# EAGLE design temp-sensor (EAGLE 9.6.2)
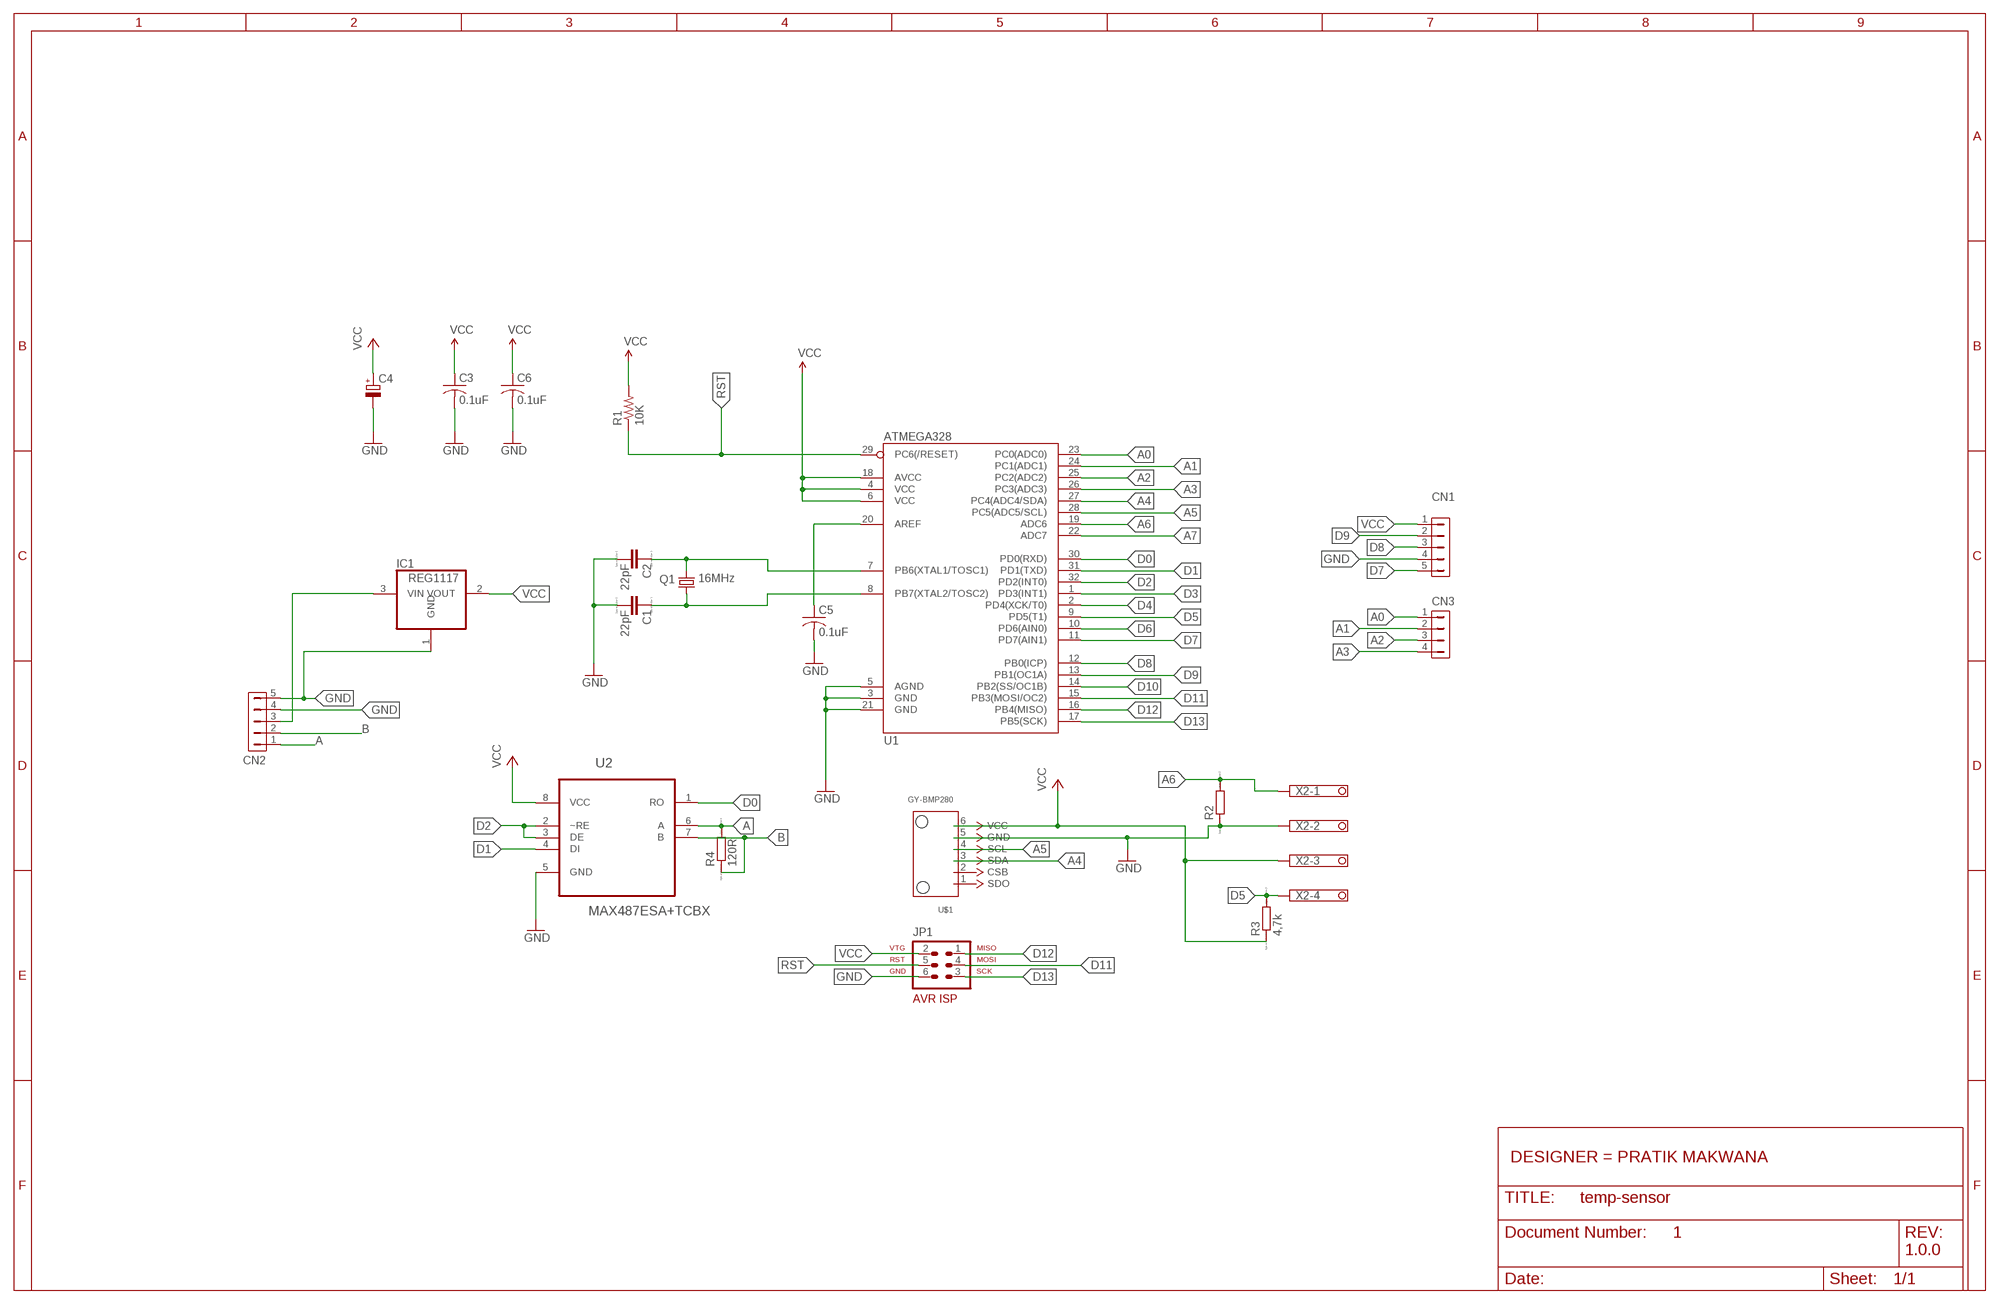
[diagram p0: schematic, sheet 1]
FRAME1 (FRAME_B_L): DESIGNER: PRATIK MAKWANA; DOC: 1; REV: 1.0.0

## Parts
C1  22pF  C  [C0805]
C2  22pF  C  [C0805]
C3  0.1uF  C-USC0805  [C0805]
C4  CPOL-EUSANYO_SMD_C6  [SANYO-OSCON_SMD_C6]
C5  0.1uF  C-USC0805  [C0805]
C6  0.1uF  C-USC0805  [C0805]
CN1  HDR-1X5-SIP-100  [SIP-100-5V]
CN2  HDR-1X5-SIP-100  [SIP-100-5V]
CN3  HDR-1X4-SIP-100  [SIP-100-4V]
IC1  REG1117  [SOT223]
JP1  AVR-ISP-6  [AVR-ISP-6]
Q1  16MHz  CRYTALHC49S  [HC49/S]
R1  10K  R-US_R1206  [R1206]
R2  RR1206  [R1206]
R3  4,7k  RR1206  [R1206]
R4  120R  RR0603  [R0603]
U1  ATMEGA328  [TQFP32-08]
U2  MAX487ESA+TCBX  [SOIC127P600X175-8N]
U$1  GY-BMP280  [GY-BMP280]
X2  TERMINAL-BLOCK-3.5MM-4-PIN-LONG-PAD  [TERMINAL-BLOCK-4-PIN-3.5MM-LONG-PAD]

## Nets
A: CN2.1 R4.2 U2.6(A)
A0: CN3.1 U1.23(PC0(ADC0))
A1: CN3.2 U1.24(PC1(ADC1))
A2: CN3.3 U1.25(PC2(ADC2))
A3: CN3.4 U1.26(PC3(ADC3))
A4: U1.27(PC4(ADC4/SDA)) U$1.3(SDA)
A5: U1.28(PC5(ADC5/SCL)) U$1.4(SCL)
A6: R2.2 U1.19(ADC6) X2.1
A7: U1.22(ADC7)
AREF: C5.1 U1.20(AREF)
B: CN2.2 R4.1 U2.7(B)
D0: U1.30(PD0(RXD)) U2.1(RO)
D1: U1.31(PD1(TXD)) U2.4(DI)
D2: U1.32(PD2(INT0)) U2.2(~RE) U2.3(DE)
D3: U1.1(PD3(INT1))
D4: U1.2(PD4(XCK/T0))
D5: R3.2 U1.9(PD5(T1)) X2.4
D6: U1.10(PD6(AIN0))
D7: CN1.5 U1.11(PD7(AIN1))
D8: CN1.3 U1.12(PB0(ICP))
D9: CN1.2 U1.13(PB1(OC1A))
D10: U1.14(PB2(SS/OC1B))
D11: JP1.4 U1.15(PB3(MOSI/OC2))
D12: JP1.1 U1.16(PB4(MISO))
D13: JP1.3 U1.17(PB5(SCK))
GND: C1.2 C2.2 C3.2 C4.- C5.2 C6.2 CN1.4 CN2.4 CN2.5 IC1.1(GND) JP1.6 R2.1 U1.3(GND) U1.5(AGND) U1.21(GND) U2.5(GND) U$1.5(GND) X2.2
N$3: CN2.3 IC1.3(VIN)
N$43: C2.1 Q1.2 U1.7(PB6(XTAL1/TOSC1))
N$44: C1.1 Q1.1 U1.8(PB7(XTAL2/TOSC2))
RST: JP1.5 R1.1 U1.29(PC6(/RESET))
VCC: C3.1 C4.+ C6.1 CN1.1 IC1.2(VOUT) JP1.2 R1.2 R3.1 U1.4(VCC) U1.6(VCC) U1.18(AVCC) U2.8(VCC) U$1.6(VCC) X2.3
Unconnected: U$1.1(SDO) U$1.2(CSB)

## Library data of the parts
C1 C2 = eagle-ltspice:C: CAPACITOR, European symbol; SPICEMODEL: NONE; SPICEPREFIX: C
C3 C5 C6 = adafruit:C-US: CAPACITOR, American symbol
C4 = rcl:CPOL-EU: POLARIZED CAPACITOR, European symbol; SPICEPREFIX: C
CN1 CN2 = con-hdrs40:HDR-1X5: HEADER CONNECTOR
CN3 = con-hdrs40:HDR-1X4: HEADER CONNECTOR
IC1 = burr-brown:REG1117: 800mA and 1A Low Dropout (LDO) Positive Regulator 1.8V, 2.5V, 2.85V, 3.3V, 5V, and Adj; MPN: REG1117; OC_FARNELL: 1097566; OC_NEWARK: 14P6981
JP1 = atmel-1:AVR-ISP-6: AVR ISP-6 Serial Programming Header
Q1 = crystal:CRYTAL: CRYSTAL
R1 = adafruit:R-US_: RESISTOR, American symbol
R2-R4 = eagle-ltspice:R: RESISTOR, European symbol; SPICEMODEL: NONE; SPICEPREFIX: R
U1 = thecustomgeek:ATMEGA328: ATmega328P-AU TQFP 32 pin
U2 = MAX487ESA_TCBX:MAX487ESA+TCBX: Low-Power, Slew-Rate-Limited RS-485/RS-422 Transceivers Check prices <https://pricing.snapeda.com/parts/MAX487ESA%2BTCBX/Maxim%20Integrated/view-part?ref=eda>; AVAILABILITY: Warning; DESCRIPTION: 1/1 Transceiver Half RS422, RS485 8-SOIC; MF: Maxim Integrated; MP: MAX487ESA+TCBX; PACKAGE: SOIC-8 Maxim Integrated; PRICE: None; PURCHASE-URL: https://pricing.snapeda.com/search/part/MAX487ESA+TCBX/?ref=eda
U$1 = GY-BMP280:GY-BMP280
X2 = Rembrandt Electronics - Terminal Block 3-5mm v1-0:TERMINAL-BLOCK-3.5MM-4-PIN: Terminal Block 3.5mm Pitch: 3,5 mm Number of pins: 4 Created by Rembrandt Electronics www.rembrandtelectronics.com

## Board
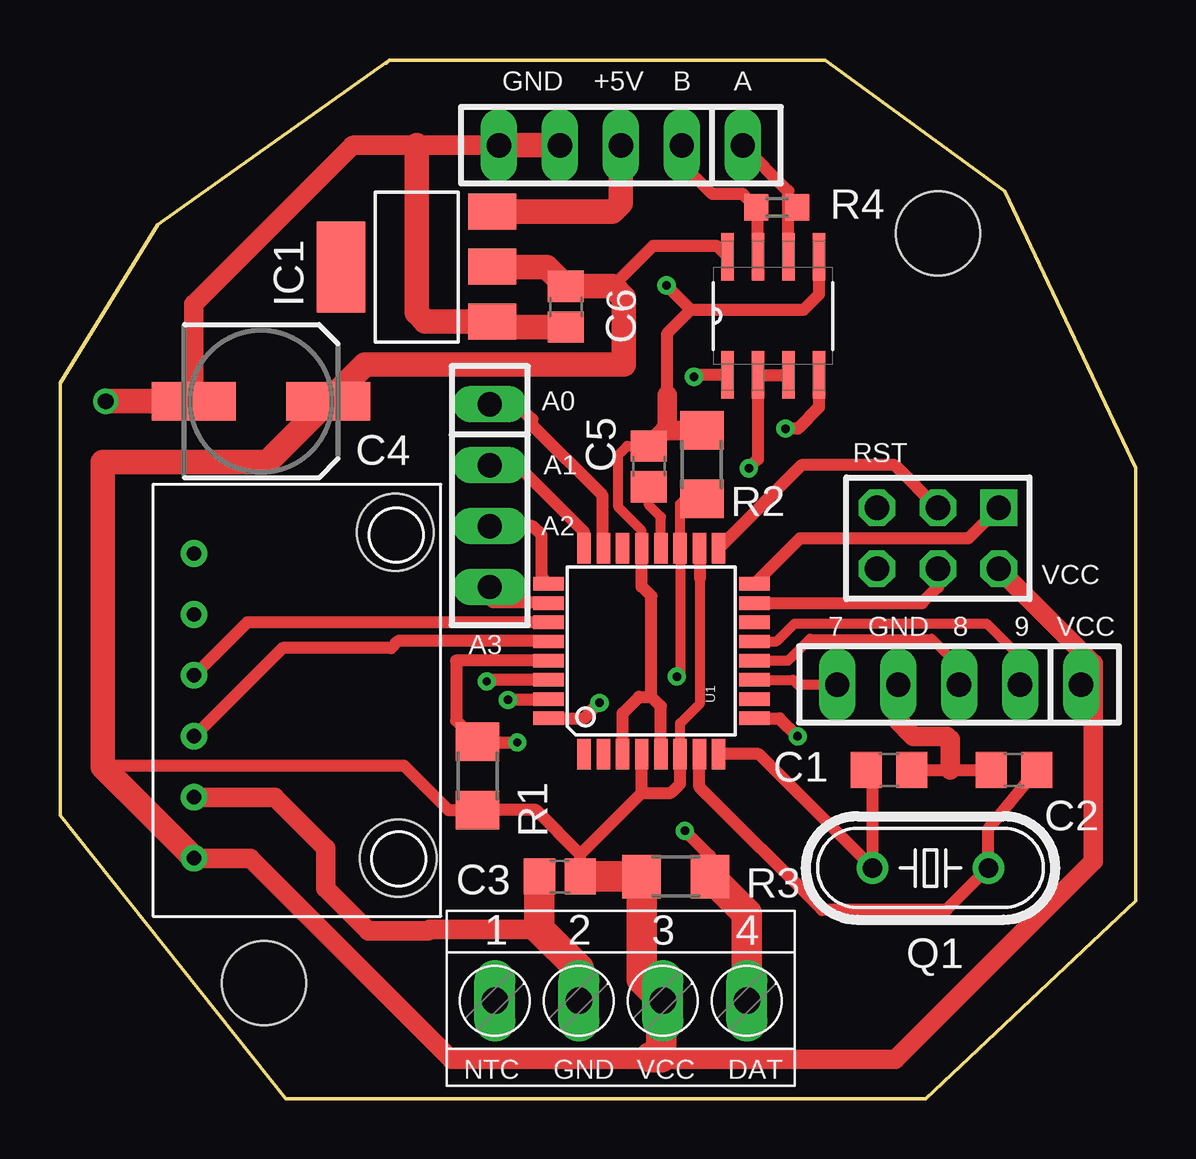
[diagram p1: board, top side]
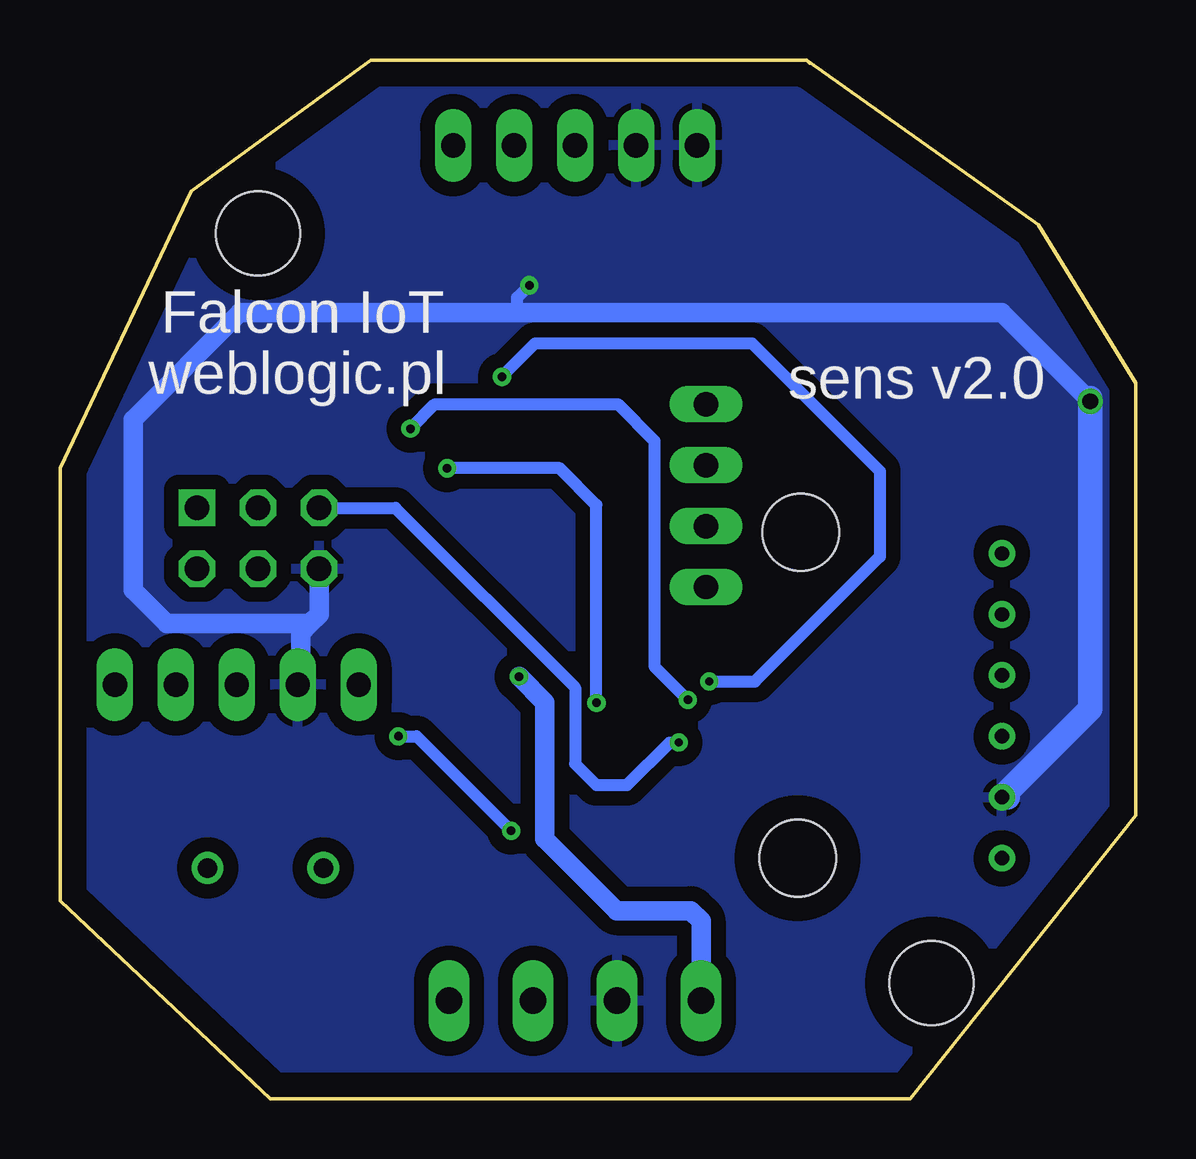
[diagram p2: board, bottom side, seen from below]

Size 44.83 x 43.31 mm. Coordinates in mm from the lower left corner, seen from the top.
Outline: 13.59,43.18 13.72,43.31
Outline: 13.72,43.31 31.88,43.31 39.37,37.85 44.83,26.29 44.83,8.26 36.07,0 9.4,0 0,11.81 0,29.84 4.06,36.45 13.72,43.31
Copper layers (1*16): Top 0.035mm / dielectric 1.5mm / Bottom 0.035mm
Design rules "default": minimum track width 6mil, minimum drill 0.35mm, track to track 6mil, track to pad 6mil, pad to pad 6mil, via to via 6mil, smd to smd 6mil, copper to edge 40mil, drill to drill 6mil, minimum pad ring 10mil, minimum via ring 8mil, stop-mask expansion 4mil, vias tented up to drill 0mil, thermal gap 10mil
Holes 3.51 mm at 36.58,36.07 8.51,4.83
Holes 3.2 mm at 14.1,10.03 13.97,23.62

### Footprints (pad centres in the part's own frame; a part is rotated, then mirrored left to right if it is on the bottom)
C0805 = smd 1.3 x 1.5: 1 -0.95,0; 2 0.95,0
C0805' = smd 1.3 x 1.5: 1 -0.85,0; 2 0.85,0
SANYO-OSCON_SMD_C6 = smd 3.5 x 1.6: + 2.8,0; - -2.8,0
SIP-100-5V = drill 1.016 long: 1 -5.08,0; 2 -2.54,0; 3 0,0; 4 2.54,0; 5 5.08,0
SIP-100-4V = drill 1.016 long: 1 -3.81,0; 2 -1.27,0; 3 1.27,0; 4 3.81,0
SOT223 = smd 1.499 x 2.007: 1 -2.261,-3.15; 2 0.025,-3.15; 3 2.311,-3.15 | smd 3.81 x 2.007: 4 0,3.15
AVR-ISP-6 = drill 1.016 square: 1 -2.54,-1.27 | drill 1.016 octagon: 2 -2.54,1.27; 3 0,-1.27; 4 0,1.27; 5 2.54,-1.27; 6 2.54,1.27
HC49/S = drill 0.813: 1 -2.413,0; 2 2.413,0
R1206 = smd 1.6 x 1.803: 1 -1.422,0; 2 1.422,0
R0603 = smd 1 x 1.1: 1 -0.85,0; 2 0.85,0
TQFP32-08 = smd 1.27 x 0.559: 1 -4.293,2.8; 2 -4.293,2; 3 -4.293,1.2; 4 -4.293,0.4; 5 -4.293,-0.4; 6 -4.293,-1.2; 7 -4.293,-2; 8 -4.293,-2.8; 17 4.293,-2.8; 18 4.293,-2; 19 4.293,-1.2; 20 4.293,-0.4; 21 4.293,0.4; 22 4.293,1.2; 23 4.293,2; 24 4.293,2.8 | smd 0.559 x 1.27: 9 -2.8,-4.293; 10 -2,-4.293; 11 -1.2,-4.293; 12 -0.4,-4.293; 13 0.4,-4.293; 14 1.2,-4.293; 15 2,-4.293; 16 2.8,-4.293; 25 2.8,4.293; 26 2,4.293; 27 1.2,4.293; 28 0.4,4.293; 29 -0.4,4.293; 30 -1.2,4.293; 31 -2,4.293; 32 -2.8,4.293
SOIC127P600X175-8N = smd 1.981 x 0.533: 1 -2.464,1.905; 2 -2.464,0.635; 3 -2.464,-0.635; 4 -2.464,-1.905; 5 2.464,-1.905; 6 2.464,-0.635; 7 2.464,0.635; 8 2.464,1.905
GY-BMP280 = drill 0.6: 1 -17.78,7.62; 2 -17.78,5.08; 3 -17.78,2.54; 4 -17.78,0; 5 -17.78,-2.54; 6 -17.78,-5.08
TERMINAL-BLOCK-4-PIN-3.5MM-LONG-PAD = drill 1.1 pad 1.7 long: 1 -5.25,-0.1; 2 -1.75,-0.1; 3 1.75,-0.1; 4 5.25,-0.1

### Placement (x,y rotation side)
C1  34.54,13.72 0 top
C2  39.75,13.72 180 top
C3  0.1uF  [C0805']  20.83,9.27 180 top
C4  8.38,29.08 0 top
C5  0.1uF  [C0805']  24.54,26.37 90 top
C6  0.1uF  [C0805']  21.08,33.02 270 top
CN1  37.47,17.27 180 top
CN2  23.37,39.75 180 top
CN3  17.91,25.15 270 top
IC1  14.86,34.67 90 top
JP1  36.58,23.37 180 top
Q1  36.27,9.63 0 top
R1  17.4,13.46 270 top
R2  26.75,26.44 270 top
R3  25.65,9.27 0 top
R4  29.87,37.16 0 top
U1  24.64,18.67 90 top
U2  29.72,32.64 90 top
U$1  23.37,15.11 0 top
X2  23.37,4.19 0 top

### Tracks (layer width: path | path; a pad name or v marks a point on that pad's centre or on a via)
A
  Top 0.508: U2.6 30.35,36.8 | 30.35,36.8 30.35,37.85 CN2.1 | R4.2 30.37,36.8 30.35,36.8
A0
  Top 0.508: 22.61,22.93 U1.23 22.61,22.99 22.61,25.15 19.68,28.07 19.68,28.32 19.05,28.96 CN3.1
A1
  Top 0.508: U1.24 21.84,23.63 19.05,26.42 CN3.2
A2
  Top 0.508: U1.25 20.07,21.75 20.07,23.49 19.68,23.88 CN3.3
A3
  Top 0.508: U1.26 20.31,20.7 18.03,20.7 17.91,20.83 CN3.4
A4
  Top 0.508: U1.27 7.8,19.87 U$1.3
A5
  Top 0.508: U1.28 20.33,19.08 14.08,19.08 13.8,18.8 9.27,18.8 U$1.4
A6  (via drill 0.35)
  Top 0.406: v25.71,17.6 25.84,17.73 U1.19 25.84,24.8 26.06,25.02 R2.2
  Bottom 0.813: v25.71,17.6 24.64,16.54 24.64,10.85 21.64,7.85 18.54,7.85 18.12,7.43 X2.1
AREF
  Top 0.406: U1.20 25.04,24.26 24.54,24.77 C5.1
B
  Top 0.508: U2.7 29.08,35.89 29.08,37.08 | 29.08,37.08 28.45,37.72 27.18,37.72 25.91,38.99 CN2.2 | R4.1 29.08,37.1 29.08,37.08
D0  (via drill 0.35)
  Top 0.508: U2.1 26.49,30.18 v26.42,30.1 | U1.30 17.85,17.47 v17.78,17.4
  Bottom 0.508: v17.78,17.4 15.88,17.4 10.67,22.61 10.67,26.16 16,31.5 25.02,31.5 v26.42,30.1
D1  (via drill 0.35)
  Top 0.508: U2.4 31.62,28.83 30.73,27.94 v30.23,27.94 | U1.31 20.31,16.64 v18.67,16.64
  Bottom 0.508: v30.23,27.94 29.21,28.96 21.59,28.96 20.07,27.43 20.07,18.03 v18.67,16.64
D2  (via drill 0.35)
  Top 0.508: U2.3 U2.2 29.08,26.67 v28.7,26.29 | U1.32 21.84,15.87 v22.48,16.51
  Bottom 0.508: v22.48,16.51 22.48,24.77 24,26.29 v28.7,26.29
D5  (via drill 0.35)
  Top 0.508: R3.2 27.08,10.13 v26.04,11.18 | U1.9 29.98,15.87 v30.73,15.11
  Top 1.27: X2.4 28.62,7.73 R3.2
  Bottom 0.508: v30.73,15.11 29.97,15.11 v26.04,11.18
D7
  Top 0.406: U1.11 30.54,17.47 30.73,17.27 CN1.5
D8
  Top 0.406: U1.12 30.33,18.27 31.24,19.18 36.32,19.18 37.47,18.03 CN1.3
D9
  Top 0.406: U1.13 29.86,19.07 30.61,19.81 38.61,19.81 40.01,18.41 CN1.2
D11
  Top 0.508: U1.15 35.91,20.67 36.58,21.34 JP1.4
D12
  Top 0.508: JP1.1 37.85,23.37 30.83,23.37 U1.16
D13
  Top 0.508: JP1.3 34.8,26.42 30.89,26.42 U1.17
GND  (via drill 0.35, 0.65)
  Top 0.406: U1.21 24.24,23.69 23.27,24.66 23.27,26.85 23.63,27.22 C5.2
  Top 0.508: U2.5 31.62,33.53 30.99,32.89 26.29,32.89 | U1.3 23.44,16.07 24.13,16.76 24.64,16.76 | C1.2 37.08,13.72 C2.2 | 24.64,16.76 25.04,16.36 U1.5 | 24.64,16.76 24.64,20.95 24.24,21.36 U1.21 | v25.27,33.91 26.29,32.89 | 26.29,32.89 25.31,31.92 25.31,29.34
  Top 0.813: CN2.5 14.86,39.75 12.24,39.75 12.19,39.73 5.58,33.12 C4.- | 37.08,13.72 37.08,14.99 36.96,15.11 35.56,15.11 34.92,15.75 CN1.4 | 19.98,7.07 15.41,7.07 15.35,7.01 12.84,7.01 11.08,8.78 11.08,10.44 8.94,12.57 U$1.5 | C5.2 25.18,27.86 | 25.18,27.86 R2.1 | 25.18,27.86 25.31,27.99 25.31,29.34
  Top 1.016: 14.86,39.75 14.86,32.77 15.21,32.41 IC1.1 18.25,32.17 C6.2 | CN2.4 CN2.5 | C4.- v1.9,29.08
  Top 1.27: X2.2 21.62,5.43 19.98,7.07 C3.2
  Bottom 0.508: 25.78,32.77 25.78,33.4 v25.27,33.91
  Bottom 0.813: 34.42,19.81 40.39,19.81 41.78,21.21 41.78,28.32 37.34,32.77 25.78,32.77 5.59,32.77 v1.9,29.08 | 34.42,19.81 34.8,19.43 34.8,17.4 CN1.4 | 34.42,19.81 34.04,20.19 JP1.6
  Bottom 1.016: 5.33,12.57 U$1.5 1.9,16.26 v1.9,29.08 1.9,29.21
  pour Bottom (isolate 0.61): 0,30 4.06,36.35 13.82,43.21 31.85,43.21 39.42,37.67 45.01,26.44 44.86,8.26 36.17,-0.03 9.19,-0.03 0,11.66 0.05,29.9
N$3
  Top 1.016: IC1.3 23.01,36.98 23.37,37.34 CN2.3
N$43
  Top 0.508: C2.1 38.68,11.25 Q1.2 36.93,7.87 31.75,7.87 26.64,12.99 U1.7
N$44
  Top 0.508: C1.1 33.86,13 Q1.1 29.11,14.38 U1.8
RST  (via drill 0.35)
  Top 0.508: U1.29 16.51,18.27 16.51,15.77 R1.1 17.42,14.86 v19.05,14.86
  Bottom 0.508: JP1.5 30.86,24.64 23.37,17.15 23.37,13.97 22.48,13.08 21.21,13.08 19.43,14.86 v19.05,14.86
VCC
  Top 0.406: CN1.1 43.05,17.78 43.05,18.16 | U1.6 25.84,15.65 26.67,16.48 26.67,21.72
  Top 0.508: C3.1 21.68,10.2 | 21.68,10.2 19.84,12.04 R1.2 16.18,12.04 14.33,13.89 1.83,13.89 1.78,13.84 | 21.68,10.2 24.24,12.76 | 24.24,12.76 U1.4 | 24.24,12.76 25.46,12.76 25.84,13.14 U1.6 | 26.67,21.72 26.67,22.93 U1.18 | 23.03,33.87 24.72,35.56 27.36,35.56 U2.8
  Top 0.813: U$1.6 7.93,10.03 16.31,1.65 34.8,1.65 43.05,9.91 43.05,18.16 JP1.2
  Top 1.016: U$1.6 1.78,13.84 1.78,26.54 8.64,26.54 C4.+ 12.71,30.61 23.5,30.61 23.5,33.4 23.03,33.87 C6.1 20.28,34.67 18.03,34.67 IC1.2
  Top 1.27: C3.1 R3.1 24.23,4.98 X2.3 25.04,4.02 25.04,1.73 24.59,1.73

### Text on the board
tNames: GND | +5V | B | A | A0 | RST | A1 | A2 | VCC | A3 | 7 | GND | 8 | 9 | VCC | NTC | GND | VCC | DAT
bNames: Falcon IoT | sens v2.0 | weblogic.pl